# EAGLE board atmega_fusebit_doctor_V2_Custom_7_usb (EAGLE 8.5.1)
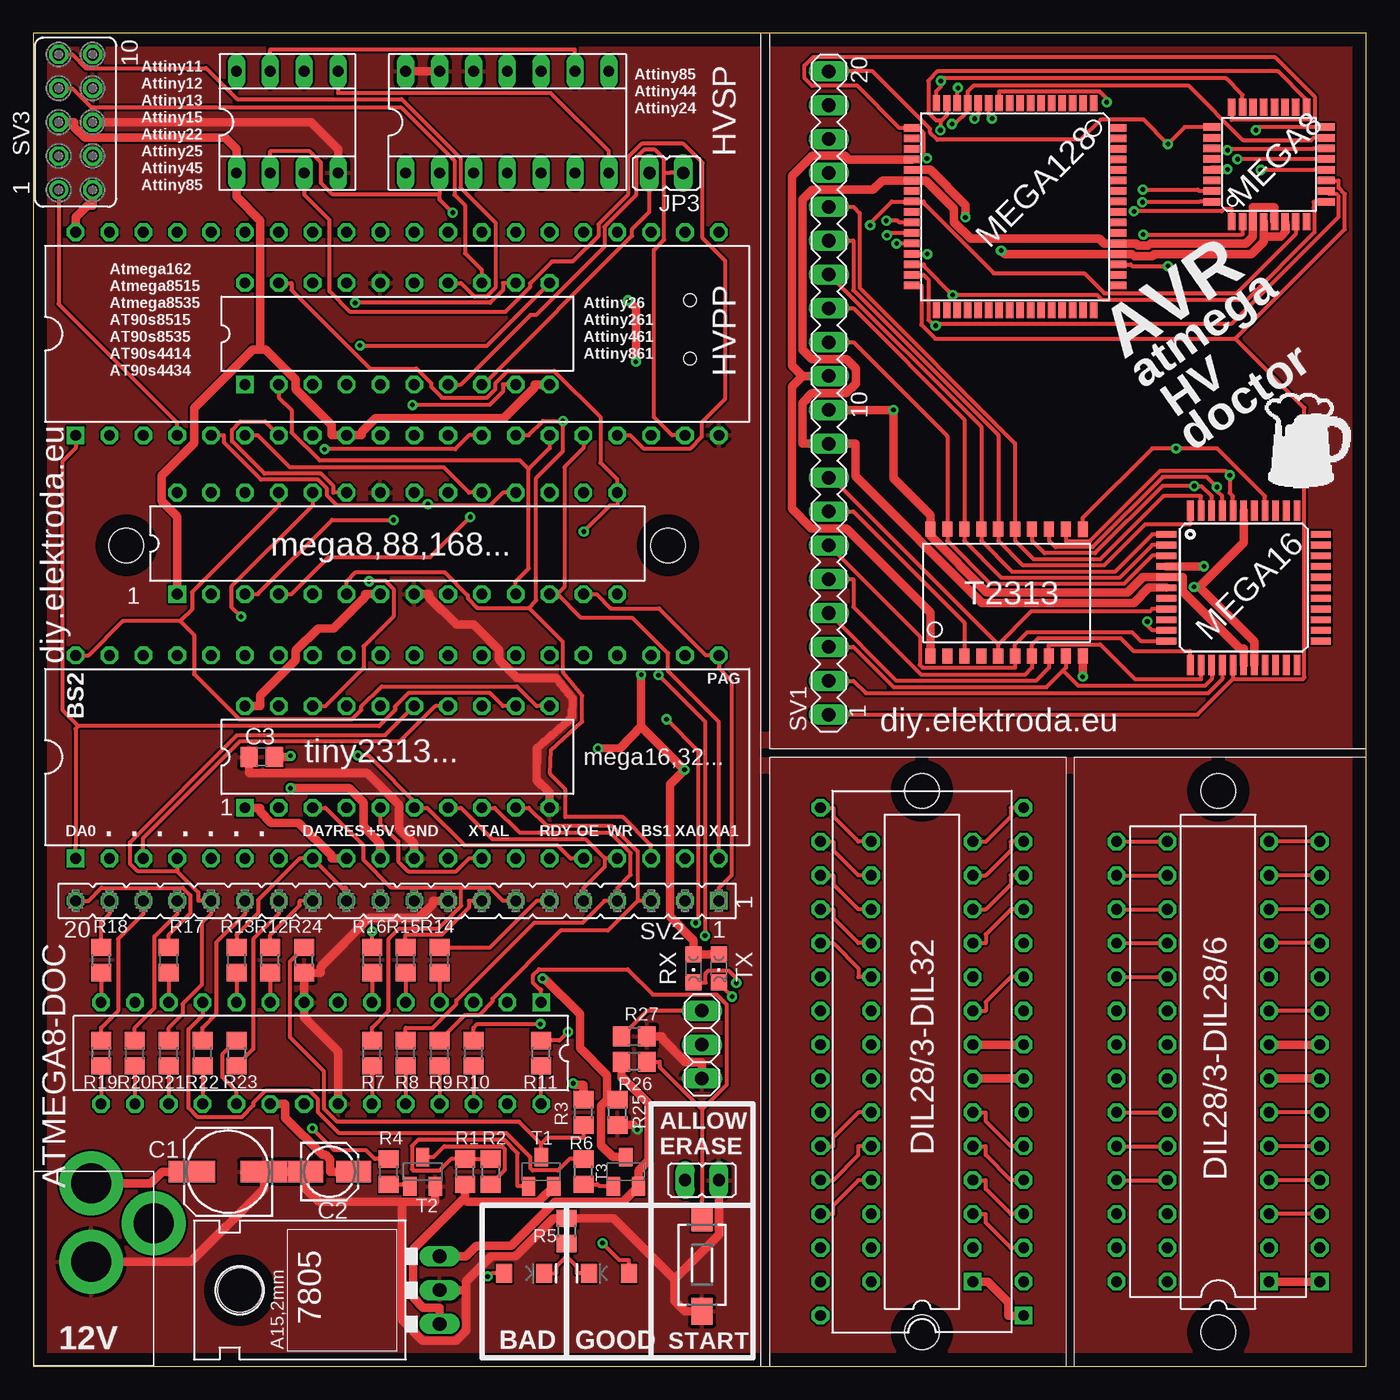
[diagram p3: board, top side]
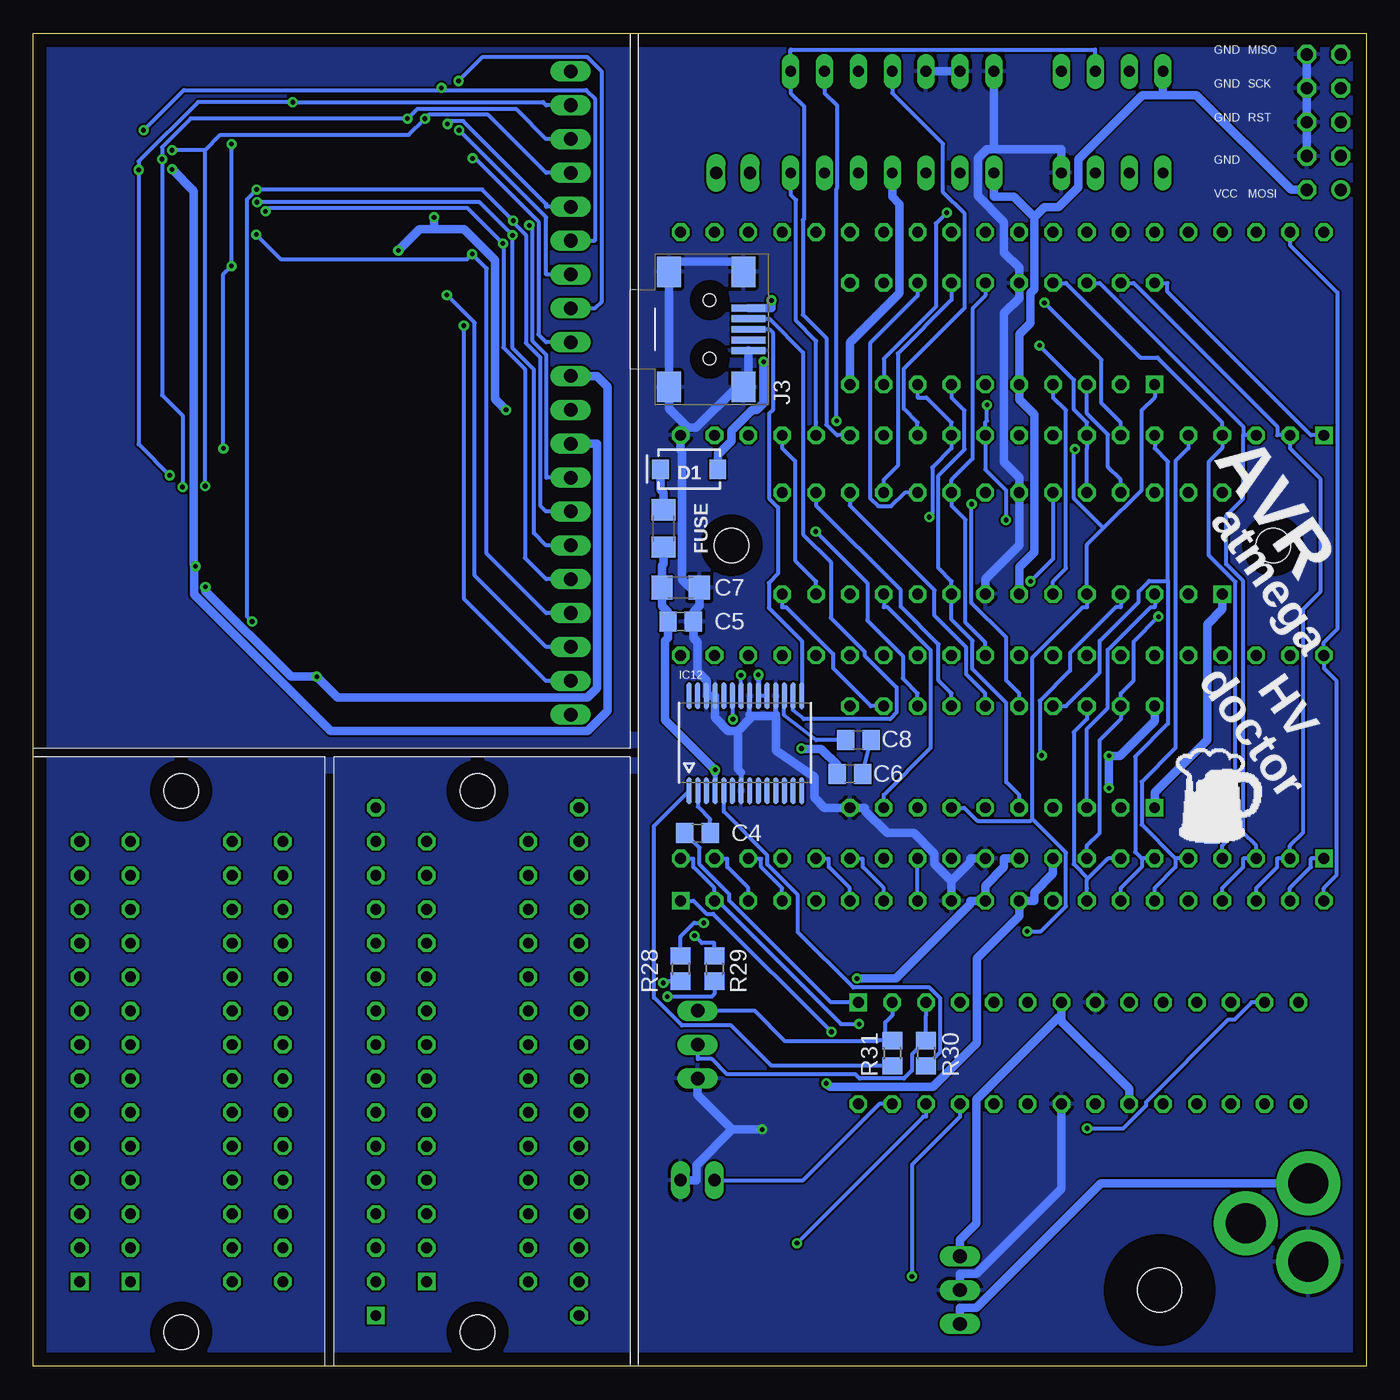
[diagram p4: board, bottom side, seen from below]

Size 100 x 100 mm. Coordinates in mm from the lower left corner, seen from the top.
Outline: 0,100 0,0 100,0 100,100 0,100
Copper layers (1*16): Top 0.035mm / dielectric 1.5mm / Bottom 0.035mm
Design rules "default": minimum track width 6mil, minimum drill 0.35mm, track to track 6mil, track to pad 6mil, pad to pad 6mil, via to via 6mil, smd to smd 6mil, copper to edge 40mil, drill to drill 6mil, minimum pad ring 10mil, minimum via ring 8mil, stop-mask expansion 4mil, vias tented up to drill 0mil, thermal gap 10mil
Net classes: 0 default: width 0.305 mm; 1 PWR: width 0.635 mm; 2 GND: width 0.635 mm
Holes 2.6 mm at 66.67,2.53 66.67,43.17 88.9,43.17 88.9,2.53 47.62,61.59 6.99,61.59

## Footprints (pad centres in the part's own frame; a part is rotated, then mirrored left to right if it is on the bottom)
153CLV-0605 = smd 3.5 x 1.6: + 2.7,0; - -2.7,0
153CLV-0405 = smd 2.6 x 1.6: + 1.8,0; - -1.8,0
C0805 = smd 1.3 x 1.5: 1 -0.95,0; 2 0.95,0
C1206 = smd 1.6 x 1.8: 1 -1.4,0; 2 1.4,0
SMA-DIODE = smd 1.27 x 1.47: A -2.15,0; C 2.15,0
1206 = smd 1.6 x 1.8: 1 -1.4,0; 2 1.4,0
78XXL = drill 1.016 long: GND 0,-3.81; IN -2.54,-3.81; OUT 2.54,-3.81 | hole 3.302: 0,11.176
DIL28-3_OCT = drill 0.813 square: 1 -16.51,-3.81 | drill 0.813 octagon: 2 -13.97,-3.81; 3 -11.43,-3.81; 4 -8.89,-3.81; 5 -6.35,-3.81; 6 -3.81,-3.81; 7 -1.27,-3.81; 8 1.27,-3.81; 9 3.81,-3.81; 10 6.35,-3.81; 11 8.89,-3.81; 12 11.43,-3.81; 13 13.97,-3.81; 14 16.51,-3.81; 15 16.51,3.81; 16 13.97,3.81; 17 11.43,3.81; 18 8.89,3.81; 19 6.35,3.81; 20 3.81,3.81; 21 1.27,3.81; 22 -1.27,3.81; 23 -3.81,3.81; 24 -6.35,3.81; 25 -8.89,3.81; 26 -11.43,3.81; 27 -13.97,3.81; 28 -16.51,3.81
DIL40_OCT = drill 0.813 square: 1 -24.13,-7.62 | drill 0.813 octagon: 2 -21.59,-7.62; 3 -19.05,-7.62; 4 -16.51,-7.62; 5 -13.97,-7.62; 6 -11.43,-7.62; 7 -8.89,-7.62; 8 -6.35,-7.62; 9 -3.81,-7.62; 10 -1.27,-7.62; 11 1.27,-7.62; 12 3.81,-7.62; 13 6.35,-7.62; 14 8.89,-7.62; 15 11.43,-7.62; 16 13.97,-7.62; 17 16.51,-7.62; 18 19.05,-7.62; 19 21.59,-7.62; 20 24.13,-7.62; 21 24.13,7.62; 22 21.59,7.62; 23 19.05,7.62; 24 16.51,7.62; 25 13.97,7.62; 26 11.43,7.62; 27 8.89,7.62; 28 6.35,7.62; 29 3.81,7.62; 30 1.27,7.62; 31 -1.27,7.62; 32 -3.81,7.62; 33 -6.35,7.62; 34 -8.89,7.62; 35 -11.43,7.62; 36 -13.97,7.62; 37 -16.51,7.62; 38 -19.05,7.62; 39 -21.59,7.62; 40 -24.13,7.62
DIL20_OCT = drill 0.813 square: 1 -11.43,-3.81 | drill 0.813 octagon: 2 -8.89,-3.81; 3 -6.35,-3.81; 4 -3.81,-3.81; 5 -1.27,-3.81; 6 1.27,-3.81; 7 3.81,-3.81; 8 6.35,-3.81; 9 8.89,-3.81; 10 11.43,-3.81; 11 11.43,3.81; 12 8.89,3.81; 13 6.35,3.81; 14 3.81,3.81; 15 1.27,3.81; 16 -1.27,3.81; 17 -3.81,3.81; 18 -6.35,3.81; 19 -8.89,3.81; 20 -11.43,3.81
SOCKED-08 = drill 0.813 long: 1 -3.81,-3.81; 2 -1.27,-3.81; 3 1.27,-3.81; 4 3.81,-3.81; 5 3.81,3.81; 6 1.27,3.81; 7 -1.27,3.81; 8 -3.81,3.81
SOCKED-14 = drill 0.813 long: 1 -7.62,-3.81; 2 -5.08,-3.81; 3 -2.54,-3.81; 4 0,-3.81; 5 2.54,-3.81; 6 5.08,-3.81; 7 7.62,-3.81; 8 7.62,3.81; 9 5.08,3.81; 10 2.54,3.81; 11 0,3.81; 12 -2.54,3.81; 13 -5.08,3.81; 14 -7.62,3.81
TQFP32-08 = smd 1.27 x 0.559: 1 -4.293,2.8; 2 -4.293,2; 3 -4.293,1.2; 4 -4.293,0.4; 5 -4.293,-0.4; 6 -4.293,-1.2; 7 -4.293,-2; 8 -4.293,-2.8; 17 4.293,-2.8; 18 4.293,-2; 19 4.293,-1.2; 20 4.293,-0.4; 21 4.293,0.4; 22 4.293,1.2; 23 4.293,2; 24 4.293,2.8 | smd 0.559 x 1.27: 9 -2.8,-4.293; 10 -2,-4.293; 11 -1.2,-4.293; 12 -0.4,-4.293; 13 0.4,-4.293; 14 1.2,-4.293; 15 2,-4.293; 16 2.8,-4.293; 25 2.8,4.293; 26 2,4.293; 27 1.2,4.293; 28 0.4,4.293; 29 -0.4,4.293; 30 -1.2,4.293; 31 -2,4.293; 32 -2.8,4.293
SSOP28 = smd 0.381 x 2.032: 1 0,0; 2 0.65,0; 3 1.3,0; 4 1.95,0; 5 2.6,0; 6 3.25,0; 7 3.9,0; 8 4.55,0; 9 5.2,0; 10 5.85,0; 11 6.5,0; 12 7.15,0; 13 7.8,0; 14 8.45,0; 15 8.45,7.112; 16 7.8,7.112; 17 7.15,7.112; 18 6.5,7.112; 19 5.85,7.112; 20 5.2,7.112; 21 4.55,7.112; 22 3.9,7.112; 23 3.25,7.112; 24 2.6,7.112; 25 1.95,7.112; 26 1.3,7.112; 27 0.65,7.112; 28 0,7.112
DIL32 = drill 0.813 square: 1 -19.05,-7.62 | drill 0.813 octagon: 2 -16.51,-7.62; 3 -13.97,-7.62; 4 -11.43,-7.62; 5 -8.89,-7.62; 6 -6.35,-7.62; 7 -3.81,-7.62; 8 -1.27,-7.62; 9 1.27,-7.62; 10 3.81,-7.62; 11 6.35,-7.62; 12 8.89,-7.62; 13 11.43,-7.62; 14 13.97,-7.62; 15 16.51,-7.62; 16 19.05,-7.62; 17 19.05,7.62; 18 16.51,7.62; 19 13.97,7.62; 20 11.43,7.62; 21 8.89,7.62; 22 6.35,7.62; 23 3.81,7.62; 24 1.27,7.62; 25 -1.27,7.62; 26 -3.81,7.62; 27 -6.35,7.62; 28 -8.89,7.62; 29 -11.43,7.62; 30 -13.97,7.62; 31 -16.51,7.62; 32 -19.05,7.62
SO20L = smd 0.762 x 1.143: 1 -5.08,-5.131; 2 -3.81,-5.131; 3 -2.54,-5.131; 4 -1.27,-5.131; 5 0,-5.131; 6 1.27,-5.131; 7 2.54,-5.131; 8 3.81,-5.131; 9 5.08,-5.131; 10 6.35,-5.131; 11 6.35,4.369; 12 5.08,4.394; 13 3.81,4.394; 14 2.54,4.394; 15 1.27,4.394; 16 0,4.394; 17 -1.27,4.394; 18 -2.54,4.394; 19 -3.81,4.394; 20 -5.08,4.394
TQFP44 = smd 1.5 x 0.5: 1 -5.8,4; 2 -5.8,3.2; 3 -5.8,2.4; 4 -5.8,1.6; 5 -5.8,0.8; 6 -5.8,0; 7 -5.8,-0.8; 8 -5.8,-1.6; 9 -5.8,-2.4; 10 -5.8,-3.2; 11 -5.8,-4; 23 5.8,-4; 24 5.8,-3.2; 25 5.8,-2.4; 26 5.8,-1.6; 27 5.8,-0.8; 28 5.8,0; 29 5.8,0.8; 30 5.8,1.6; 31 5.8,2.4; 32 5.8,3.2; 33 5.8,4 | smd 0.5 x 1.5: 12 -4,-5.8; 13 -3.2,-5.8; 14 -2.4,-5.8; 15 -1.6,-5.8; 16 -0.8,-5.8; 17 0,-5.8; 18 0.8,-5.8; 19 1.6,-5.8; 20 2.4,-5.8; 21 3.2,-5.8; 22 4,-5.8; 34 4,5.8; 35 3.2,5.8; 36 2.4,5.8; 37 1.6,5.8; 38 0.8,5.8; 39 0,5.8; 40 -0.8,5.8; 41 -1.6,5.8; 42 -2.4,5.8; 43 -3.2,5.8; 44 -4,5.8
TQFP64 = smd 1.194 x 0.559: 1 -7.76,5.905; 2 -7.76,5.118; 3 -7.76,4.331; 4 -7.76,3.543; 5 -7.76,2.756; 6 -7.76,1.968; 7 -7.76,1.181; 8 -7.76,0.394; 9 -7.76,-0.394; 10 -7.76,-1.181; 11 -7.76,-1.968; 12 -7.76,-2.756; 13 -7.76,-3.543; 14 -7.76,-4.331; 15 -7.76,-5.118; 16 -7.76,-5.905; 33 7.76,-5.905; 34 7.76,-5.118; 35 7.76,-4.331; 36 7.76,-3.543; 37 7.76,-2.756; 38 7.76,-1.968; 39 7.76,-1.181; 40 7.76,-0.394; 41 7.76,0.394; 42 7.76,1.181; 43 7.76,1.968; 44 7.76,2.756; 45 7.76,3.543; 46 7.76,4.331; 47 7.76,5.118; 48 7.76,5.905 | smd 0.559 x 1.194: 17 -5.905,-7.76; 18 -5.118,-7.76; 19 -4.331,-7.76; 20 -3.543,-7.76; 21 -2.756,-7.76; 22 -1.968,-7.76; 23 -1.181,-7.76; 24 -0.394,-7.76; 25 0.394,-7.76; 26 1.181,-7.76; 27 1.968,-7.76; 28 2.756,-7.76; 29 3.543,-7.76; 30 4.331,-7.76; 31 5.118,-7.76; 32 5.905,-7.76; 49 5.905,7.76; 50 5.118,7.76; 51 4.331,7.76; 52 3.543,7.76; 53 2.756,7.76; 54 1.968,7.76; 55 1.181,7.76; 56 0.394,7.76; 57 -0.394,7.76; 58 -1.181,7.76; 59 -1.968,7.76; 60 -2.756,7.76; 61 -3.543,7.76; 62 -4.331,7.76; 63 -5.118,7.76; 64 -5.905,7.76
DIL28-6 = drill 0.813 square: 1 -16.51,-7.62 | drill 0.813 octagon: 2 -13.97,-7.62; 3 -11.43,-7.62; 4 -8.89,-7.62; 5 -6.35,-7.62; 6 -3.81,-7.62; 7 -1.27,-7.62; 8 1.27,-7.62; 9 3.81,-7.62; 10 6.35,-7.62; 11 8.89,-7.62; 12 11.43,-7.62; 13 13.97,-7.62; 14 16.51,-7.62; 15 16.51,7.62; 16 13.97,7.62; 17 11.43,7.62; 18 8.89,7.62; 19 6.35,7.62; 20 3.81,7.62; 21 1.27,7.62; 22 -1.27,7.62; 23 -3.81,7.62; 24 -6.35,7.62; 25 -8.89,7.62; 26 -11.43,7.62; 27 -13.97,7.62; 28 -16.51,7.62
USB-MINI-B_2 = smd 0.508 x 2.54: 1 0,0; 2 0.8,0; 3 1.6,0; 4 2.4,0; 5 3.2,0 | smd 2.286 x 1.778: 6 -2.717,5.948; 7 -2.717,0.36; 8 5.918,0.36; 9 5.918,5.948 | hole 0.95: -0.6,2.9; 3.8,2.9
JP1 = drill 0.914 long: 1 0,-1.27; 2 0,1.27
1X03 = drill 1.016 long: 1 -2.54,0; 2 0,0; 3 2.54,0
LED-1206 = smd 1.2 x 1.4: A -1.5,0; C 1.5,0
R0805 = smd 1.3 x 1.5: 1 -0.95,0; 2 0.95,0
CHIPLED_0805 = smd 1.2 x 1.2: A 0,-1.05; C 0,1.05
DTSM-3 = smd 2 x 1.6: 1 -3.494,0; 2 3.494,0
MA20-1 = drill 1.016 long: 1 -24.13,0; 2 -21.59,0; 3 -19.05,0; 4 -16.51,0; 5 -13.97,0; 6 -11.43,0; 7 -8.89,0; 8 -6.35,0; 9 -3.81,0; 10 -1.27,0; 11 1.27,0; 12 3.81,0; 13 6.35,0; 14 8.89,0; 15 11.43,0; 16 13.97,0; 17 16.51,0; 18 19.05,0; 19 21.59,0; 20 24.13,0
FE20 = drill 0.813 square: 1 -24.13,0 | drill 0.813 octagon: 2 -21.59,0; 3 -19.05,0; 4 -16.51,0; 5 -13.97,0; 6 -11.43,0; 7 -8.89,0; 8 -6.35,0; 9 -3.81,0; 10 -1.27,0; 11 1.27,0; 12 3.81,0; 13 6.35,0; 14 8.89,0; 15 11.43,0; 16 13.97,0; 17 16.51,0; 18 19.05,0; 19 21.59,0; 20 24.13,0
FE05-2 = drill 0.914: 1 -5.08,1.27 | drill 0.914 octagon: 2 -5.08,-1.27; 3 -2.54,1.27; 4 -2.54,-1.27; 5 0,1.27; 6 0,-1.27; 7 2.54,1.27; 8 2.54,-1.27; 9 5.08,1.27; 10 5.08,-1.27
SOT23-BEC = smd 1 x 1.4: B -0.95,-1.1; C 0,1.1; E 0.95,-1.1
SOT23 = smd 1 x 1.4: 1 -0.95,-1.1; 2 0.95,-1.1; 3 0,1.1
PJ-102A = drill 3 pad 4.8: RING 0.1,-3.39; RING_SW -4.6,-6.29; TIP 0.1,-9.29

## Placement (x,y rotation side)
C1  100uF  [153CLV-0605]  14.61,14.59 180 top
C2  10uF  [153CLV-0405]  22.23,14.59 0 top
C3  10nF  [C0805]  17.14,45.71 180 top
C4  100nF  [C0805]  50.16,39.99 0 bottom
C5  100nF  [C0805]  51.44,55.87 0 bottom
C6  100nF  [C0805]  38.73,44.44 180 bottom
C7  4,7uF  [C1206]  51.44,58.41 0 bottom
C8  100nF  [C0805]  38.1,46.98 180 bottom
D1  1A/40V/500mV  [SMA-DIODE]  50.8,67.3 180 bottom
FUSE  6V/0.5A  [1206]  52.7,62.85 90 bottom
IC1  7805  [78XXL]  26.67,5.71 90 top
IC2  ATMEGA8-DOC  [DIL28-3_OCT]  21.59,23.48 180 top
IC3  MEGA16/32/644...  [DIL40_OCT]  27.3,45.71 0 top
IC4  MEGA8/88/168...  [DIL28-3_OCT]  27.3,61.73 0 top
IC5  AT90S2313/TINY2313  [DIL20_OCT]  27.3,45.71 0 top
IC6  [SOCKED-08]  19.05,93.34 0 top
IC7  [SOCKED-14]  35.56,93.34 0 top
IC8  AT90S8515PDIL40_OCT  [DIL40_OCT]  27.3,77.46 0 top
IC9  TINY26  [DIL20_OCT]  27.3,77.46 0 top
IC10  MEGA8/88/168...  [DIL28-3_OCT]  66.67,22.85 90 top
IC11  MEGA8-AI  [TQFP32-08]  92.71,90.16 90 top
IC12  FT232RL  [SSOP28]  50.8,43.17 0 bottom
IC13  [DIL32]  66.67,22.85 90 top
IC14  TINY2313  [SO20L]  72.39,58.41 0 top
IC15  MEGA16  [TQFP44]  90.81,58.41 0 top
IC16  MEGA128-A  [TQFP64]  73.66,86.98 270 top
IC17  MEGA8/88/168...  [DIL28-3_OCT]  88.9,22.85 90 top
IC18  [DIL28-6]  88.9,22.85 90 top
J3  [USB-MINI-B_2]  46.35,76.19 90 bottom
JP1  ERASE  [JP1]  50.16,13.96 90 top
JP2  RS232  [1X03]  50.16,24.12 90 top
JP3  HVSP  [JP1]  47.5,89.53 90 top
LED1  red  [LED-1206]  36.83,6.97 0 top
LED2  green  [LED-1206]  43.18,6.97 180 top
R1  10K  [R0805]  32.38,14.59 90 top
R2  1K  [R0805]  34.29,14.59 270 top
R3  100  [R0805]  41.27,19.04 90 top
R4  4K7  [R0805]  26.67,14.59 90 top
R5  330  [R0805]  40.01,10.15 270 top
R6  4K7  [R0805]  41.27,14.59 90 top
R7  1K  [R0805]  25.4,23.48 90 top
R8  1K  [R0805]  27.94,23.48 90 top
R9  1K  [R0805]  30.48,23.48 90 top
R10  1K  [R0805]  33.02,23.48 90 top
R11  1K  [R0805]  38.1,23.48 90 top
R12  1K  [R0805]  17.78,30.47 90 top
R13  1K  [R0805]  15.24,30.47 90 top
R14  1K  [R0805]  30.48,30.47 90 top
R15  1K  [R0805]  27.94,30.47 90 top
R16  1K  [R0805]  25.4,30.47 90 top
R17  1K  [R0805]  10.16,30.47 90 top
R18  1K  [R0805]  5.08,30.47 90 top
R19  1K  [R0805]  5.08,23.48 90 top
R20  1K  [R0805]  7.62,23.48 90 top
R21  1K  [R0805]  10.16,23.48 90 top
R22  1K  [R0805]  12.7,23.48 90 top
R23  1K  [R0805]  15.24,23.48 270 top
R24  1K  [R0805]  20.32,30.47 90 top
R25  100  [R0805]  43.81,19.04 90 top
R26  1K  [R0805]  45.09,22.85 180 top
R27  10K  [R0805]  45.09,24.75 0 top
R28  1K  [R0805]  51.44,29.84 270 bottom
R29  1K  [R0805]  48.9,29.84 270 bottom
R30  1K  [R0805]  33.02,23.48 270 bottom
R31  1K  [R0805]  35.56,23.48 270 bottom
RX  Red  [CHIPLED_0805]  49.53,29.84 180 top
START  DTSM-3  [DTSM-3]  50.16,7.61 90 top
SV1  [MA20-1]  59.69,73.02 90 top
SV2  [FE20]  27.3,34.91 180 top
SV3  [FE05-2]  3.17,93.34 90 top
T1  BC857  [SOT23-BEC]  38.1,14.59 0 top
T2  BC847  [SOT23]  29.21,14.59 0 top
T3  BC557  [SOT23-BEC]  44.45,14.59 0 top
TX  Green  [CHIPLED_0805]  51.44,29.84 180 top
U$3  2.1MMJACKTHM  [PJ-102A]  4.45,4.44 180 top

## Tracks (layer width: path | path; a pad name or v marks a point on that pad's centre or on a via)
1
  Top 0.305: IC10.5 71.45,16.5 71.45,15.84 73.33,13.96 IC13.5
2
  Top 0.305: IC10.6 71.45,19.04 71.45,18.38 73.33,16.5 IC13.6
3
  Top 0.635: IC18.1 IC17.1
4
  Top 0.635: IC13.8 IC10.7
5
  Top 0.635: IC13.9 IC10.8
7
  Top 0.305: IC10.9 71.45,26.66 71.45,27.32 73.33,29.2 IC13.11
9
  Top 0.305: IC10.11 71.45,31.74 71.45,32.4 73.33,34.28 IC13.13
10
  Top 0.305: IC13.14 73.33,36.82 73.33,36.16 71.45,34.28 IC10.12
11
  Top 0.305: IC13.15 73.33,39.36 73.33,38.7 71.45,36.82 IC10.13
12
  Top 0.305: IC13.16 73.33,41.9 73.33,41.24 71.45,39.36 IC10.14
13
  Top 0.305: IC13.17 60.02,41.9 60.02,41.24 61.9,39.36 IC10.15
14
  Top 0.305: IC13.18 60.02,39.36 60.02,38.7 61.9,36.82 IC10.16
15
  Top 0.305: IC13.19 60.02,36.82 60.02,36.16 61.9,34.28 IC10.17
16
  Top 0.305: IC13.20 60.02,34.28 60.02,33.62 61.9,31.74 IC10.18
17
  Top 0.305: IC10.19 61.9,29.2 61.9,29.86 60.02,31.74 IC13.21
19
  Top 0.305: IC18.3 IC17.3
20
  Top 0.305: IC18.4 IC17.4
21
  Top 0.305: IC18.5 IC17.5
22
  Top 0.305: IC18.6 IC17.6
23
  Top 0.305: IC13.27 60.02,16.5 60.02,17.16 61.9,19.04 IC10.23
24
  Top 0.305: IC10.24 61.9,16.5 61.9,15.84 60.02,13.96 IC13.28
25
  Top 0.305: IC13.29 60.02,11.42 60.02,12.08 61.9,13.96 IC10.25
29
  Top 0.635: IC13.1 73.17,3.8 73.17,4.79 71.61,6.34 IC10.1
31
  Top 0.305: IC10.3 71.45,11.42 71.45,10.76 73.33,8.88 IC13.3
32
  Top 0.305: IC10.4 71.45,13.96 71.45,13.3 73.33,11.42 IC13.4
33
  Top 0.635: IC18.7 IC17.7
34
  Top 0.635: IC18.8 IC17.8
35
  Top 0.305: IC18.9 IC17.9
37
  Top 0.305: IC18.11 IC17.11
38
  Top 0.305: IC18.12 IC17.12
39
  Top 0.305: IC18.13 IC17.13
40
  Top 0.305: IC18.14 IC17.14
41
  Top 0.305: IC18.15 IC17.15
42
  Top 0.305: IC18.16 IC17.16
43
  Top 0.305: IC18.17 IC17.17
44
  Top 0.305: IC18.18 IC17.18
45
  Top 0.305: IC18.19 IC17.19
47
  Top 0.305: IC18.23 IC17.23
48
  Top 0.305: IC18.24 IC17.24
49
  Top 0.305: IC18.25 IC17.25
+5V  (via drill 0.35 pad 0.76)
  Top 0.635: v38.2,29.09 38.34,29.09 41,26.42 41,23.86 43.06,21.81 43.06,19.99 | 43.06,19.99 43.17,19.99 R25.2 | 43.06,19.99 42.59,19.52 42.59,16.58 43.48,15.7 T3.C | IC4.7 24.91,57.92 24.91,57.71 22.54,55.35 21.35,55.35 19.68,53.68 19.68,53 17,50.32 17,49.52 IC5.20 | v19.3,43.37 23.68,43.37 24.77,42.28 24.77,40.49 26.04,39.22 IC3.10 | v19.3,45.79 19.21,45.71 C3.1 | SV3.2 4.45,87.07 4.04,87.07 3.17,86.21 IC8.40
  Bottom 0.635: SV3.2 5.63,88.26 12.72,95.35 15.24,95.35 | IC6.8 15.24,95.35 | 24.9,86.21 24.14,86.97 23.08,86.97 21.59,88.46 21.59,90.55 16.78,95.35 15.24,95.35 | 24.9,86.21 26.43,87.73 27.94,87.73 IC7.1 | 24.9,86.21 24.9,80.8 25.18,80.52 25.18,78.27 26.04,77.41 IC9.5 26.04,72.52 24.9,71.39 24.9,61.09 26.04,59.96 26.04,59.05 IC4.7 | v38.2,29.09 35.3,29.09 29.7,34.68 29.7,34.91 SV2.10 28.57,35.48 28.57,36.05 27.16,37.45 27.16,38.09 IC3.10 | v19.3,43.37 v19.3,45.79 18.47,45.79 15.88,48.39 IC5.20
+5V*  (via drill 0.35 pad 0.76)
  Top 0.559: IC16.52 | 66.75,89.76 66.74,89.74 IC16.21 | IC16.52 | 93.96,85.6 93.96,85.82 IC11.6
  Top 0.635: IC15.17 90.81,53.83 90.53,53.83 86.22,58.13 86.22,59.21 IC15.5 83.23,59.21 82.08,58.05 71.56,58.05 67.31,62.3 IC14.20 67.31,63.85 64.53,66.62 v64.53,71.75 61.49,71.75 SV1.10 | IC16.52 72.88,83.44 v72.61,83.71 | 66.75,89.76 67.3,89.76 69.93,87.12 v69.93,86.19 | IC16.52 82.42,83.44 82.59,83.27 83.94,83.27 84.12,83.44 91.37,83.44 92.31,84.38 92.31,84.76 | 93.96,85.6 93.96,85.14 93.58,84.76 92.31,84.76 | IC11.4 92.31,84.76
  Bottom 0.635: 69.93,85.3 67.66,85.3 65.35,82.99 65.35,72.57 v64.53,71.75 | 69.93,85.3 71.02,85.3 v72.61,83.71 | 69.93,85.3 v69.93,86.19
+12V  (via drill 0.35 pad 0.76)
  Top 0.635: R3.2 41.27,21.11 40.62,21.11 v40.51,21.22 | 17.03,76.25 17.44,76.25 19.68,74 19.68,73.3 22.36,70.62 22.36,69.84 IC8.9 24.62,69.84 24.62,70.07 25.68,71.13 35.31,71.13 37.6,73.43 37.6,73.65 IC9.10 | SV3.5 3.09,93.34 3.09,92.97 3.9,92.15 14.4,92.15 15.24,91.32 IC6.1 15.24,87.73 17.03,85.94 17.03,76.25 | IC4.1 10.79,63.74 9.64,64.9 9.64,66.82 12.06,69.24 12.06,71.87 16.45,76.25 17.03,76.25 | IC3.9 22.36,38.09 22.36,38.32 19.92,40.77 17.85,40.77 17,41.62 17,41.9 IC5.1
  Bottom 0.635: IC5.1 15.88,43.03 11.93,46.98 11.93,55.66 10.79,56.79 IC4.1 | IC3.9 23.5,36.96 24.91,35.55 24.91,34.91 SV2.11 26.04,33.79 29.21,30.61 29.21,24.26 32.52,20.96 40.24,20.96 v40.51,21.22 | IC7.4 35.56,87.73 35,87.18 35,80.51 38.73,76.78 38.73,74.78 IC9.10
+12V*  (via drill 0.35 pad 0.76)
  Top 0.635: v87.83,60.01 IC15.4 | IC11.29 89.52,89.76 89.56,89.79 v89.59,89.79 | 57.7,74.29 56.91,73.5 56.91,64.34 58.4,62.85 60.99,62.85 67.31,56.54 IC14.1 | IC16.20 61.19,90.53 60.91,90.81 58.45,90.81 56.91,89.27 56.91,75.07 57.7,74.29 | SV1.11 57.7,74.29
  Bottom 0.635: v89.59,89.79 87.95,88.15 87.95,60.13 v87.83,60.01 87.94,59.9 87.94,57.9 77.68,47.64 58.43,47.64 56.91,49.16 56.91,73.5 57.7,74.29 SV1.11
AVCC
  Bottom 0.305: IC9.15 28.57,80.31 29.54,79.34 29.54,68.08 31.11,66.51 IC4.20 31.11,64.58 30.06,63.52 30.06,55.78 28.57,54.3 IC3.30
BS1  (via drill 0.35 pad 0.76)
  Top 0.305: 37.18,56.9 37.73,57.45 37.73,66.64 39.74,68.65 v39.74,70.92 38.24,70.92 37.16,69.84 IC8.14 | IC4.6 23.5,58.88 24.19,59.58 30.84,59.58 32.58,57.84 32.58,57.62 33.3,56.9 37.18,56.9 | IC3.18 46.35,39.08 44.25,41.19 39.93,41.19 39.93,43.27 38.79,44.41 38.84,46.22 41.17,48.35 41.17,50.31 39.75,52.05 39.74,52.73 39.74,54.35 37.18,56.9 | R8.2 27.94,25.39 29.96,25.39 31.75,27.18 31.75,27.45 37.59,33.29 41.23,33.29 42.85,34.91 SV2.4 43.81,35.88 44.82,36.88 44.82,38.5 43.31,40.01 36.51,40.01 34.62,41.9 IC5.8 | IC6.7 17.78,98.77 40.64,98.77 IC7.9
  Bottom 0.305: IC3.18 45.39,38.09 45.39,37.45 43.81,35.88 SV2.4 | IC9.4 23.5,72.69 22.53,71.72 22.53,59.85 23.5,58.88 IC4.6 | v39.74,70.92 39.74,88.34 39.67,88.4 39.67,94.55 40.64,95.52 IC7.9
BS1*  (via drill 0.35 pad 0.76)
  Top 0.305: SV1.4 64.77,51.42 75.22,51.42 76.2,52.4 IC14.8 76.2,54.16 80.04,54.16 82.64,51.55 87.61,51.55 IC15.13 | IC11.2 90.71,84.93 90.69,84.9 v83.27,84.9 | IC16.29 v67.07,83.44
  Bottom 0.305: v83.27,84.9 81.39,83.02 67.49,83.02 v67.07,83.44 65.97,82.35 65.97,60.96 61.52,56.51 SV1.4
BS2
  Top 0.305: IC5.11 37.77,49.52 36.28,51.01 26.13,51.01 24.6,49.48 24.6,49.24 23.9,48.54 15.44,48.54 12.06,51.92 12.06,54.86 11.03,55.9 | 11.03,55.9 6.71,55.9 4.14,53.33 IC3.40 | 11.03,55.9 11.9,56.78 11.9,58.06 18.41,64.58 IC4.25 | R17.2 10.16,32.38 11.77,33.99 11.77,35.33 11.22,35.88 5.11,35.88 4.14,34.91 SV2.20
  Bottom 0.305: IC4.25 18.41,66.51 19.38,67.47 19.38,69.88 20.95,71.45 IC9.3 | SV2.20 3.17,35.88 2.21,36.85 2.21,51.4 3.17,52.37 IC3.40 3.17,54.3 2.16,55.31 2.16,80.56 5.71,84.12 IC8.39
BS2*  (via drill 0.35 pad 0.76)
  Top 0.305: SV1.20 62.96,97.15 67.27,92.83 67.27,92.56 67.82,92.01 78.56,92.01 80.08,93.52 83.3,93.52 v85.13,91.69 86.39,92.96 87.48,92.96 IC11.25 | IC16.51 82.32,82.65 82.43,82.55 v85.13,82.55 | IC14.11 78.74,63.66 83.94,68.86 v85.74,68.86 88.81,68.86 92.41,65.27 IC15.37
  Bottom 0.305: v85.13,91.69 v85.13,82.55 85.74,81.94 v85.74,68.86
COM
  Bottom 0.305: C6.1 C8.1
DATA0
  Top 0.305: 3.38,48.03 25.96,48.03 27.14,49.21 27.14,49.49 28.15,50.5 34.25,50.5 35.23,49.52 IC5.12 | 3.38,48.03 3.17,47.83 3.17,39.05 IC3.1 | 3.38,48.03 2.21,49.2 2.21,67.91 3.17,68.88 IC8.1 | SV2.19 5.71,33.95 5.08,33.31 R18.2
  Bottom 0.305: IC3.1 4.14,38.09 4.14,37.45 5.71,35.88 SV2.19 | IC9.20 14.91,81.27 14.91,80.61 4.14,69.84 IC8.1 | IC4.14 43.81,56.95 43.52,56.95 40.01,53.45 40.01,52.37 37.16,49.52 IC5.12
DATA0*  (via drill 0.35 pad 0.76)
  Top 0.305: IC15.40 90,65.27 89.76,65.51 v89.76,66.84 89.42,67.18 84.55,67.18 79.27,61.9 77.5,61.9 77.47,61.93 IC14.12 | v80.53,94.83 80.53,95.11 80,95.65 72.48,95.65 IC16.10 | v92.1,89.75 96.05,89.75 96.06,89.76 IC11.12
  Bottom 0.305: v89.76,66.84 92.1,69.17 v92.1,89.75 92.1,90.39 87.65,94.83 v80.53,94.83 61.75,94.83 61.52,94.61 SV1.19
DATA1  (via drill 0.35 pad 0.76)
  Top 0.305: IC9.19 19.38,81.27 19.38,80.74 25.27,74.85 28.75,74.85 29.84,73.75 29.84,73.48 30.66,72.67 34.04,72.67 34.67,73.3 34.67,73.75 35.59,74.67 39.09,74.67 42.55,71.21 42.55,67.78 43.81,66.51 IC4.15 43.81,64.58 43.26,64.58 v41.3,62.62 | R19.2 5.08,25.39 6.35,26.66 6.35,32.05 8.26,33.95 SV2.18
  Bottom 0.305: IC5.13 33.66,50.48 34.77,51.6 34.77,53.29 37.43,55.95 37.43,58.75 v41.3,62.62 | SV2.18 8.26,35.88 6.68,37.45 6.68,38.09 IC3.2 5.71,39.05 4.75,40.02 4.75,56.76 3.45,58.06 3.45,66.61 5.71,68.88 IC8.2 6.68,69.84 6.68,70.5 17.45,81.27 IC9.19
DATA1*  (via drill 0.35 pad 0.76)
  Top 0.305: v71.93,93.6 71.69,93.84 IC16.11 | IC15.41 89.2,65.27 88.8,65.67 v88.8,65.95 88.04,66.72 84.73,66.72 79.46,61.45 76.68,61.45 76.2,61.93 IC14.13 | v90.34,90.56 96.06,90.56 IC11.13
  Bottom 0.305: v88.8,65.95 88.8,71.31 90.34,72.86 v90.34,90.56 90.34,91.46 88.2,93.6 v71.93,93.6 71.18,94.34 63.8,94.34 61.52,92.07 SV1.18
DATA2
  Top 0.305: IC3.3 8.26,39.64 15.5,46.89 27.52,46.89 30.15,49.52 IC5.14 | SV2.17 10.79,33.95 9.11,32.26 9.11,26.88 7.62,25.39 R20.2
  Bottom 0.305: IC4.16 41.27,64.58 34.92,58.23 34.92,56.99 32.08,54.14 32.08,51.45 31.11,50.48 IC5.14 | SV2.17 10.79,35.88 9.22,37.45 9.22,38.09 IC3.3 8.26,39.05 9.22,40.02 9.22,58.89 10.5,60.17 10.5,63.82 9.22,65.09 9.22,69.84 | IC8.3 9.22,69.84 | IC9.18 19.99,81.27 9.22,70.5 9.22,69.84
DATA2*  (via drill 0.35 pad 0.76)
  Top 0.305: IC16.12 70.9,93.84 70.86,93.84 v70.62,93.6 | IC11.14 96.06,91.36 89.72,91.36 v89.59,91.24 | IC14.14 74.93,61.93 75.87,60.99 79.65,60.99 84.69,66.03 v87.11,66.03 87.64,66.03 88.41,65.27 IC15.42
  Bottom 0.305: 87.11,91.24 85.97,92.38 71.83,92.38 v70.62,93.6 70.33,93.88 65.88,93.88 61.52,89.53 SV1.17 | 87.11,91.24 v89.59,91.24 | v87.11,66.03 87.11,91.24
DATA3
  Top 0.305: 10.79,37.12 7.83,37.12 7.27,37.69 7.27,39.3 15.31,47.34 26.4,47.34 IC5.15 | 10.79,37.12 10.79,37.24 IC3.4 | 10.79,37.12 12.37,35.55 12.37,34.91 SV2.16 13.34,33.95 12.64,33.26 12.64,28.62 11.19,27.17 11.19,26.42 10.16,25.39 R21.2 | IC8.4 10.79,70.81 1.91,79.7 SV3.1
  Bottom 0.305: IC4.17 38.73,64.58 32.38,58.23 32.38,56.32 30,53.93 30,51.91 28.57,50.48 IC5.15 | IC3.4 10.79,39.05 9.81,40.04 9.81,58.84 11.8,60.82 11.8,67.87 10.79,68.88 IC8.4 10.79,70.81 15.67,75.68 16.94,75.68 22.53,81.27 IC9.17
DATA3*  (via drill 0.35 pad 0.76)
  Top 0.305: IC11.15 96.06,92.16 95.9,92 90.76,92 86.65,96.1 70.57,96.1 70.12,95.65 IC16.13 70.12,94.17 69.15,93.2 v68.93,93.2 | IC15.43 87.61,65.27 84.76,65.27 80.03,60.53 75.06,60.53 73.66,61.93 IC14.15 73.66,69.23 61.99,80.91 61.99,86.52 61.52,86.98 SV1.16
  Bottom 0.305: SV1.16 61.52,86.98 61.52,87.2 67.74,93.42 68.72,93.42 v68.93,93.2
DATA4  (via drill 0.35 pad 0.76)
  Top 0.305: IC9.14 32.08,81.27 33.11,80.24 34,80.24 34.66,80.91 34.66,85.81 32.05,88.42 32.05,90.64 27.62,95.06 15.3,95.06 12.96,97.4 3.94,97.4 2.92,98.42 SV3.9 | IC8.5 14.3,69.84 14.3,69.3 17.09,66.51 21.36,66.51 22.03,65.83 22.03,65.32 22.78,64.58 29.49,64.58 v29.6,64.68 29.72,64.56 34.25,64.56 35.23,65.54 IC4.18 | R22.2 12.7,25.39 13.73,26.42 13.73,31.8 15.88,33.95 SV2.15
  Bottom 0.305: IC5.16 26.04,50.48 27,51.45 27,54.67 29.6,57.27 v29.6,64.68 | IC4.18 36.2,66.51 35.14,67.56 35.14,75.98 31.11,80.01 31.11,80.31 IC9.14 | 14.3,38.09 16.84,40.63 16.84,43.84 14.3,46.38 14.3,67.91 13.34,68.88 IC8.5 | 14.3,38.09 14.3,37.45 15.88,35.88 SV2.15 | IC3.5 14.3,38.09
DATA4*  (via drill 0.35 pad 0.76)
  Top 0.305: IC15.44 86.81,63.16 83.41,63.16 80.32,60.07 74.25,60.07 72.39,61.93 IC14.16 72.39,69.85 61.52,80.72 61.52,84.45 SV1.15 | v69.38,95.9 69.33,95.85 69.33,95.65 IC16.14 | IC11.16 91.96,92.96 v91.73,92.73
  Bottom 0.305: 69.38,95.74 58.52,95.74 57.86,95.08 57.86,84.45 SV1.15 | v91.73,92.73 88.72,95.74 69.38,95.74 | 69.38,95.74 v69.38,95.9
DATA5
  Top 0.305: IC9.13 33.66,82.23 32.38,83.51 32.38,87.1 31.59,87.89 31.59,90.44 27.59,94.44 4.35,94.44 2.92,95.88 SV3.7 | IC8.6 16.84,69.84 19.26,67.42 30.81,67.42 32.69,65.54 IC4.19 | SV2.14 18.41,33.95 16.51,32.05 16.51,23.8 R23.2
  Bottom 0.305: IC4.19 34.62,65.54 35.64,64.52 36.6,64.52 37.21,65.13 37.21,76.75 33.66,80.31 IC9.13 | 16.84,38.09 16.84,37.45 18.41,35.88 SV2.14 | 14.86,58.91 14.86,48.2 17.32,45.74 17.32,38.57 16.84,38.09 | 16.84,38.09 | IC3.6 16.84,38.09 | 14.86,58.91 14.86,67.86 15.88,68.88 IC8.6 | 14.86,58.91 16.28,58.91 17.07,58.12 17.07,57.34 19.99,54.41 19.99,52.06 22.53,49.52 IC5.17
DATA5*  (via drill 0.35 pad 0.76)
  Top 0.305: IC11.17 95.51,95.03 93.39,97.15 67.85,97.15 67.14,96.44 67.14,94.04 67.72,93.46 68.06,93.46 | 68.06,93.46 68.16,93.46 68.54,93.84 IC16.15 | 68.06,93.46 v68.06,92.73 | SV1.14 71.12,70.48 IC14.17 71.12,61.93 73.45,59.6 81.14,59.6 83.95,62.41 IC15.1
  Bottom 0.305: v68.06,92.73 61.52,86.19 61.52,81.91 SV1.14
DATA6  (via drill 0.35 pad 0.76)
  Top 0.305: v25.18,58.88 25.24,58.94 26.4,58.94 27.02,58.32 27.02,56.26 24.77,54 24.77,52.37 21.92,49.52 IC5.18 | IC8.7 17.38,70.88 15.53,70.88 14.9,70.25 14.9,69.4 17.34,66.96 21.59,66.96 22.53,66.03 22.53,65.54 IC4.23 | v24.14,79.78 34.28,79.78 35.23,80.73 35.23,81.27 IC9.12 | SV2.13 19.99,34.91 19.99,34.59 17.78,32.38 R12.2
  Bottom 0.305: IC4.23 23.5,60.57 v25.18,58.88 | v24.14,79.78 19.86,75.5 19.86,72.25 18.41,70.81 IC8.7 | 20.86,36.61 19.38,38.09 IC3.7 | 20.86,36.61 20.95,36.52 20.95,35.88 SV2.13 | 20.86,36.61 21.93,37.67 21.93,47.58 20.95,48.55 IC5.18
DATA6*  (via drill 0.35 pad 0.76)
  Top 0.305: IC11.23 90.71,95.39 89.49,96.61 68.28,96.61 v68.09,96.43 68.09,95.98 67.75,95.65 IC16.16 | IC15.2 83.95,61.61 81.48,59.14 72.64,59.14 69.85,61.93 IC14.18 69.85,71.03 61.52,79.37 SV1.13
  Bottom 0.305: v68.09,96.43 66.28,98.23 58.45,98.23 57.38,97.17 57.38,79.84 57.86,79.37 SV1.13
DATA7  (via drill 0.35 pad 0.76)
  Top 0.305: v24.51,76.58 34.05,76.58 IC9.11 | v15.58,56.23 14.86,56.95 14.86,58.48 20.95,64.58 IC4.24 | SV2.12 23.5,35.88 23.16,35.88 IC3.8 19.99,38.09 16.86,34.97 16.86,34 15.24,32.38 R13.2
  Bottom 0.305: IC3.8 20.95,39.05 19.99,40.02 19.99,46.98 18.41,48.55 IC5.19 18.41,50.48 17.45,51.45 17.45,54.36 v15.58,56.23 | v24.51,76.58 21.92,73.99 21.92,71.77 20.95,70.81 IC8.8 20.95,69.36 20.95,68.88 IC4.24
DATA7*  (via drill 0.35 pad 0.76)
  Top 0.305: v67.05,90.62 66.81,90.86 66.81,92.52 66.44,92.89 IC16.17 65,92.89 61.82,96.07 58.42,96.07 57.85,96.64 57.85,97.57 58.51,98.24 93.14,98.24 96.13,95.25 96.13,93.7 95.94,93.51 89.91,93.51 IC11.24 | IC15.3 83.95,60.81 81.82,58.68 71.82,58.68 68.58,61.93 IC14.19 68.58,69.76 61.52,76.83 SV1.12
  Bottom 0.305: v67.05,90.62 66.84,90.62 62.1,85.88 62.1,77.41 61.52,76.83 SV1.12
GND  (via drill 0.35 pad 0.76)
  Top 0.635: SV2.9 29.98,34.91 29.98,34.68 28.92,33.62 25.2,33.62 21.54,29.95 21.54,29.52 R24.1 IC2.8 20.32,26.16 22.86,23.62 IC2.22 | 48.12,6.52 51.44,9.84 JP1.1 | 48.12,6.52 43.54,11.1 R5.1 39.04,11.1 36.18,8.25 34.36,8.25 32.47,6.36 32.47,5.71 | 48.12,6.52 48.12,4.9 48.9,4.12 START.1 | R25.1 45.03,18.09 45.03,18.05 v45.32,17.76 | IC4.8 29.7,57.92 29.7,57.69 31.77,55.62 33.03,55.62 34.92,53.73 34.92,53 36.3,51.63 39.22,51.63 40.44,50.08 40.44,48.68 39.19,47.59 38.58,47.06 37.8,46.37 37.77,44 38.73,43.03 IC5.10 | IC6.4 22.86,91.32 20.84,93.34 SV3.6 | 27.66,12.32 30.16,12.32 T2.2 | 27.66,12.32 21.43,12.32 20.43,13.32 C2.- C1.- 17.3,13.32 11.8,7.83 U$3.RING | 27.66,12.32 27.66,3.46 29.22,1.91 31.73,1.91 32.47,2.65 32.47,5.71 | IC7.14 IC7.13 | IC1.GND 32.47,5.71 | JP2.1 50.16,22.81 48.93,22.81 47.16,24.59 47.16,24.75 R27.2 | C3.2 16.2,44.49 25.06,44.49 27.45,42.1 27.45,40.35 28.57,39.22 IC3.11
  Bottom 0.381: 46.9,44.55 IC12.7 | 49.3,50.28 49.45,50.28 IC12.26 | 46.25,48.9 IC12.21 | 44.3,48.9 IC12.18 | 48.86,50.27 IC12.25
  Bottom 0.635: IC6.4 22.86,91.32 27.94,91.32 | 27.94,91.32 28.46,91.32 29.13,90.65 29.13,87.81 27.16,85.85 27.16,83.53 26.04,82.4 IC9.16 26.04,80.14 27.18,78.99 27.18,67.82 26.04,66.67 IC4.22 26.04,61.59 28.57,59.05 IC4.8 | 27.94,91.32 | 27.94,91.32 IC7.14 | 47.58,17.76 v45.32,17.76 | 47.58,17.76 50.16,20.35 JP2.1 | 47.58,17.76 50.25,15.09 50.25,13.96 JP1.1 | 47.14,47.66 46.11,48.69 46.11,48.76 | 47.14,47.66 47.87,47.66 48.86,48.66 48.86,50.27 49.28,50.27 49.3,50.28 | 47.14,47.66 47.14,44.79 46.9,44.55 | 46.11,48.76 46.25,48.9 | 44.3,48.76 46.11,48.76 | 44.3,48.76 44.3,48.9 | 44.3,48.76 44.3,46.18 41.4,44.19 41.4,42.69 40.63,41.9 IC5.10 37.6,41.9 37.6,41.67 35.93,39.99 33.95,39.99 32.38,38.43 32.38,37.67 31.12,36.41 | 31.12,36.41 31.11,36.4 SV2.9 | 31.12,36.41 29.7,37.82 29.7,38.09 IC3.11 | 49.45,50.28 49.45,51.4 50.16,52.12 50.16,54.33 50.48,54.65 C5.2 50.48,56.59 50.03,57.04 50.03,57.73 | SV3.4 SV3.6 SV3.8 SV3.10 | 50.87,70.41 52.3,71.84 J3.6 J3.9 51.55,82.86 47.46,82.86 J3.8 | 50.87,70.41 50.27,70.41 47.21,73.47 J3.7 46.35,73.83 J3.1 | 50.87,70.41 IC8.20 51.44,68.71 51.34,68.61 51.34,59.02 50.03,57.73 | C7.2 50.03,57.73 | IC2.22 22.86,13.32 29.25,6.94 30.48,6.94 IC1.GND | IC7.13 IC7.12
  pour Top: 0,0 0,100 100,100 100,0
  pour Bottom: 0,0 0,100 100,100 100,0
  cutout Bottom: 54.61,46.34 99.06,46.34 99.06,45.71 54.61,45.71
  cutout Bottom: 54.61,0.62 55.24,0.62 55.24,44.44 54.61,44.44
  cutout Bottom: 77.47,0.62 78.11,0.62 78.11,44.44 77.47,44.44
  cutout Bottom: 54.61,99.69 55.24,99.69 55.24,47.62 54.61,47.62
  cutout Top: 54.61,99.69 55.24,99.69 55.24,47.62 54.61,47.62
  cutout Top: 54.61,0.62 55.24,0.62 55.24,44.44 54.61,44.44
  cutout Top: 77.47,0.62 78.11,0.62 78.11,44.44 77.47,44.44
  cutout Top: 54.61,45.71 54.61,46.34 99.69,46.34 99.69,45.71
GND*  (via drill 0.35 pad 0.76)
  Top 0.635: IC15.6 83.71,58.41 82.56,57.27 71.19,57.27 61.68,66.77 61.68,69.21 SV1.9 57.7,69.21 57.7,72.27 58.42,72.99 60.97,72.99 61.71,73.73 61.71,74.85 61,75.56 58.42,75.56 57.7,76.28 57.7,87.51 58.44,88.26 63,88.26 63.69,88.95 IC16.22 66.43,88.95 66.97,88.95 69.09,86.83 69.09,85.84 70.33,84.6 79.98,84.6 80.35,84.23 IC16.53 82.49,84.23 82.74,84.23 82.92,84.05 83.62,84.05 83.79,84.23 90.98,84.23 91.51,84.76 IC11.3 91.51,86.97 93.11,86.97 IC11.5 | 87.49,58.47 90.81,61.78 IC15.39 | v87.09,58.47 87.49,58.47 | 87.49,58.47 91.61,54.35 IC15.18 | v78.73,51.73 v78.74,51.74 IC14.10
  Bottom 0.635: v87.09,58.47 87.09,58.17 80.65,51.73 v78.73,51.73 77.15,50.16 58.42,50.16 57.7,50.88 57.7,69.21 SV1.9
N$1
  Top 0.305: R6.1 42.33,13.64 42.48,13.5 T3.B
N$2
  Top 0.305: R18.1 IC2.14
N$3
  Bottom 0.305: C8.2 41.27,46.98 43.66,48.83 43.66,50.19 IC12.17
N$4
  Top 0.305: IC2.28 38.1,21.58 R11.1
N$5
  Top 0.305: R16.1 IC2.6
N$6
  Top 0.305: R14.1 IC2.4
N$8
  Top 0.305: T2.3 30.02,15.7 30.82,16.5 35.17,16.5 35.34,16.32 35.34,14.7 R2.2
N$9
  Top 0.305: R12.1 IC2.9
N$10
  Top 0.305: R13.1 IC2.10
N$11  (via drill 0.35 pad 0.76)
  Top 0.305: R4.2 25.61,15.55 24.97,16.2 22.58,16.2 v20.94,17.84
  Bottom 0.305: IC2.13 8.59,27.29 9.87,26.01 10.33,26.01 16.51,19.83 16.51,19.56 18.23,17.84 v20.94,17.84
N$12
  Top 0.305: IC2.11 12.7,26.33 11.64,25.27 11.64,19.36 12.32,18.69 15.64,18.69 16.51,19.56 16.51,19.77 17.38,20.64 20.73,20.64 21.36,20.01 21.36,19.06 22.95,17.47 35.5,17.47 37.3,15.67 37.3,14.85 37.47,14.68 39.35,14.68 40.22,15.55 R6.2
N$14
  Top 0.305: R19.1 IC2.15
N$16
  Top 0.305: R20.1 IC2.16
N$19
  Top 0.305: R15.1 IC2.5
N$21
  Top 0.305: R7.1 IC2.23
N$22
  Top 0.305: 38.1,16.7 36.46,18.34 22.8,18.34 21.82,19.32 21.82,22.11 19.26,24.67 19.26,30.36 R24.2 | 38.1,16.7 38.53,17.14 41.27,17.14 R3.1 | T1.C 38.1,16.7
N$24
  Top 0.305: R21.1 IC2.17
N$25
  Top 0.305: R22.1 IC2.18
N$26
  Top 0.305: IC2.19 15.24,20.64 14.19,21.7 14.19,23.38 R23.1
N$27
  Top 0.305: R17.1 IC2.12
N$29
  Top 0.305: R4.1 27.73,13.64 27.88,13.5 T2.1
N$31
  Bottom 0.305: IC2.27 36.52,19.68 42.24,13.96 JP1.2
N$32
  Top 0.305: LED2.C 40.77,6.97 40.77,7.47 40.01,8.25 | LED1.C 39.23,6.97 39.23,7.47 40.01,8.25 | R5.2 40.01,8.25
N$34
  Top 0.305: T1.B 36.34,13.5 36.34,15.97 35.34,16.98 28.86,16.98 28.41,16.53 28.41,14.79 28.51,14.69 30.48,14.69 31.33,15.55 R1.2 R2.1
N$41
  Bottom 0.305: IC12.2 50.15,41.98 49.22,41.05 C4.2
N$42
  Top 0.305: R8.1 IC2.24
N$44
  Bottom 0.305: J3.3 44.78,77.79 44.52,77.53 44.52,71.75 44.79,71.48 44.79,65.1 44.12,64.43 44.12,59.47 44.82,58.77 44.82,56.88 42.35,54.41 IC12.15
N$45
  Bottom 0.305: J3.4 44.78,78.59 42.24,76.05 42.24,62.4 40.17,60.32 40.17,56.15 37.63,53.61 37.63,53.33 35.23,50.93 35.23,49.05 35.71,48.55 42.19,48.55 43,49.2 IC12.16
N$46  (via drill 0.35 pad 0.76)
  Top 0.305: v47.51,48.54 49.88,46.17 49.88,33.44 v49.7,33.26
  Bottom 0.305: R28.1 51.44,32.24 50.42,33.26 v49.7,33.26 | v47.51,48.54 47.51,50.24 IC12.23
N$47  (via drill 0.35 pad 0.76)
  Top 0.305: LED2.A 44.68,7.98 43.96,7.98 v42.71,9.23 | R10.1 IC2.26
  Bottom 0.305: IC2.26 33.02,18.71 33.23,18.71 v42.71,9.23
N$48  (via drill 0.35 pad 0.76)
  Top 0.305: LED1.A 34.42,6.97 34.19,6.74 v34.08,6.74 | R9.1 IC2.25
  Bottom 0.305: IC2.25 30.48,18.71 34.08,15.11 v34.08,6.74
N$50  (via drill 0.35 pad 0.76)
  Top 0.305: v46.9,51.85 50.4,48.35 v50.4,32.29
  Bottom 0.305: R29.1 48.9,31.74 49.85,31.74 v50.4,32.29 | IC12.22 v46.9,51.85
N$51  (via drill 0.35 pad 0.76)
  Top 0.305: RX.C 50.44,28.79 50.44,29.46 50.66,29.69 52.16,29.69 52.74,29.11 v52.74,28.76
  Bottom 0.305: R28.2 52.49,28.88 52.61,28.88 v52.74,28.76
N$52  (via drill 0.35 pad 0.76)
  Top 0.305: TX.C 51.44,28.72 v52.43,27.73
  Bottom 0.305: v52.43,27.73 49.1,27.73 48.9,27.93 R29.2
OE  (via drill 0.35 pad 0.76)
  Top 0.305: 29.06,41.9 25.14,45.82 v24.35,45.82 | v24.35,45.82 | 29.06,41.9 29.54,41.9 32.35,39.09 39.31,39.09 40.31,38.09 IC3.16 | IC5.6 29.06,41.9 | v32.78,63.7 29.75,60.67 22.13,60.67 19.38,57.92 IC4.4 | IC9.8 33.77,73.65 44.92,84.8 44.92,85.3 46.23,86.6 JP3.2 | R14.2 34.27,31.42 37.77,34.91 SV2.6
  Bottom 0.305: IC4.4 18.41,56.95 18.78,56.95 22.23,53.51 22.23,52.18 24.49,49.92 24.49,45.96 v24.35,45.82 | IC3.16 40.31,38.09 40.31,37.45 38.73,35.88 SV2.6 | v32.78,63.7 32.56,63.92 32.56,67.43 31.11,68.88 IC8.12 31.11,70.32 31.11,70.81 32.99,72.69 33.66,72.69 IC9.8
OE*  (via drill 0.35 pad 0.76)
  Top 0.305: IC15.11 83.08,54.41 82.41,55.08 74.58,55.08 73.66,54.16 IC14.6 73.66,52.4 66.74,52.4 66.52,52.62 66.52,54.76 SV1.6 | v83.22,87.33 87.45,87.33 87.48,87.36 IC11.32 | IC16.27 64.21,85.02 v64.04,84.85
  Bottom 0.305: v83.22,87.33 66.52,87.33 v64.04,84.85 64.04,76.38 62.43,74.77 62.43,62.5 61.52,61.59 SV1.6
PAG  (via drill 0.35 pad 0.76)
  Top 0.305: v40.12,25.08 39.48,24.43 R11.2 | SV2.1 51.44,35.88 52.41,36.86 52.41,51.38 51.44,52.37 IC3.21 50.47,53.33 46.95,56.85 43.31,56.85 42.24,57.92 IC4.13 | IC6.3 20.32,87.9 22.23,85.99 22.23,80.65 23.78,79.1 35.4,79.1 37.27,80.97 37.27,81.23 38.91,82.87 40.47,82.87 42.39,84.79 42.39,85.67 44.61,87.89 44.61,90.7 45.62,91.71 48.78,91.71 50.21,90.28 50.21,84.62 51.91,82.92 51.91,72.58 50.16,70.83 50.16,69.73 49.3,68.86 45.76,68.86 44.78,69.84 IC8.17
  Bottom 0.305: SV2.1 50.47,34.91 49.5,33.95 48.99,33.95 v40.12,25.08 | IC8.17 43.81,68.88 42.85,67.91 42.85,60.46 41.27,58.88 IC4.13
PAG*
  Top 0.305: 90.18,77.08 98.41,85.3 98.41,87.95 97.94,88.41 97.94,88.96 IC11.11 | 90.18,77.08 67.68,77.08 66.61,78.14 66.61,81.08 IC16.32 | 90,51.55 95.25,51.55 95.37,51.68 95.37,71.88 90.18,77.08 | SV1.1 87.33,48.88 90,51.55 | IC15.16 90,51.55
RDY  (via drill 0.35 pad 0.76)
  Top 0.305: 32.1,35.89 26.86,35.89 24.77,37.99 24.77,39.05 21.92,41.9 IC5.3 | 32.1,35.89 32.1,34.54 30.4,32.83 27.45,32.83 26.67,32.05 26.67,26.66 25.4,25.39 R7.2 | 32.1,35.89 34.25,35.89 35.23,34.91 SV2.7 | v27.02,63.48 22.4,63.48 16.84,57.92 IC4.3 | v28.45,72.12 34.24,72.12 35.23,73.11 35.23,73.65 IC9.9 | v31.47,86.54 30.48,87.53 30.48,87.9 | 30.48,87.9 22.46,87.9 21.59,88.77 21.59,90.3 20.74,91.15 17.78,91.15 IC6.2 | IC7.2 30.48,87.9
  Bottom 0.305: IC3.15 37.77,38.09 37.77,37.45 36.2,35.88 SV2.7 | v28.45,72.12 28.45,70.94 28.57,70.81 IC8.11 28.57,67.27 27.02,65.72 v27.02,63.48 | v31.47,86.54 32.28,85.73 32.28,79.49 36.2,75.58 IC9.9 | IC4.3 15.88,56.95 16.18,56.95 19.39,53.74 19.39,49.38 20.95,47.82 IC5.3
RDY*  (via drill 0.35 pad 0.76)
  Top 0.305: v83.58,55.86 83.58,55.58 83.95,55.21 IC15.10 | IC14.3 69.85,55.79 61.52,64.12 SV1.7 | IC11.31 87.48,88.16 87.36,88.28 v83.24,88.28 | v63.99,85.94 64.86,85.94 65,85.8 IC16.26
  Bottom 0.305: v83.58,55.86 83.99,56.27 83.99,87.53 v83.24,88.28 66.33,88.28 v63.99,85.94 63.99,85.83 63.04,84.87 63.04,76.76 61.98,75.7 61.98,64.58 61.52,64.12 SV1.7
RX232
  Bottom 0.305: IC12.1 53.44,40.53 53.44,27.65 51.35,25.56 47.64,25.56 44.61,22.54 36.62,22.54 R31.2
RXD
  Top 0.305: JP2.3 46.04,26.66 R27.1
  Bottom 0.305: IC2.2 35.56,26.33 36.09,25.8 36.09,24.43 | 36.09,24.43 36.62,24.43 36.67,24.38 43.59,24.38 45.87,26.66 JP2.3 | R31.1 36.09,24.43
START
  Top 0.305: 50.16,19.28 52.01,21.12 52.01,27.14 51.27,27.88 46.49,27.88 44.59,29.78 37.93,29.78 37.5,29.35 37.5,28.75 37.99,28.26 38.1,28.26 IC2.1 | 50.16,19.28 50.16,12.41 START.2 | 50.16,19.28 46.99,22.45 46.99,22.85 R26.1
  Bottom 0.305: IC2.1 40.16,27.29 47.78,34.91 47.78,35.41 50,37.64 50,38.88 C4.1
TX232
  Bottom 0.305: R30.2 31.96,23.6 31.96,27.61 32.76,28.4 38.48,28.4 42.64,32.56 42.64,35.35 44.92,37.64 44.92,38.34 48.2,41.61 IC12.5
TXD
  Bottom 0.305: JP2.2 50.16,23.05 49.1,23.05 47.95,21.9 38.34,21.9 38.01,21.58 34.68,21.58 34.08,22.18 34.08,23.38 R30.1 33.02,26.33 IC2.3
V+
  Top 0.635: T1.E 37.88,12.32 32.59,12.32 32.38,12.52 | R1.1 32.38,12.52 | IC1.IN 30.48,4.4 29.25,4.4 28.48,5.16 28.48,8.78 32.23,12.52 32.38,12.52 | C1.+ 9.69,14.59 8.81,13.73 U$3.TIP
  Bottom 0.635: IC1.IN 30.48,4.4 29.25,4.4 19.92,13.73 U$3.TIP
VCC
  Top 0.635: C2.+ 22.25,14.59 22.25,15.53 21.92,15.86 21.69,15.86 18.91,18.65 18.91,19.68 IC2.20 | R26.2 44.13,21.63 44.24,21.63 46.17,19.7 46.17,15.44 45.4,14.66 T3.E 44.23,12.32 39.15,12.32 35.86,9.03 33.26,9.03 32.47,8.25 IC1.OUT
  Bottom 0.635: IC2.20 17.78,20.8 22.86,25.88 22.86,26.16 | IC2.7 22.86,26.16 | IC1.OUT 30.48,9.48 29.25,10.71 29.25,20.01 23.09,26.16 22.86,26.16
VUSB  (via drill 0.35, 0.35 pad 0.76)
  Top 0.635: TX.A RX.A 49.53,31.95 47.76,33.73 47.76,43.65 v48.85,44.75 45.6,48 | 45.6,48 v45.6,51.88 | v42.37,46.34 44.07,46.37 45.6,48
  Bottom 0.305: IC12.19 IC12.20
  Bottom 0.381: 48.85,44.55 IC12.4 | 45.6,51.66 IC12.20
  Bottom 0.406: C6.2 39.69,45.11 | 42.34,46.32 v42.37,46.34
  Bottom 0.635: 48.85,44.55 v48.85,44.75 52.59,48.48 52.59,54.45 52.38,54.65 C5.1 52.38,56.59 52.84,57.04 C7.1 52.84,60.05 52.7,60.19 FUSE.1 | 45.6,51.66 v45.6,51.88 | 39.69,45.11 40.89,46.32 42.34,46.32
VUSB_PREFUSE
  Bottom 0.635: FUSE.2 52.7,65.53 52.95,65.77 D1.C
VUSB_RAW  (via drill 0.35 pad 0.76)
  Top 0.635: v45.21,75.36 45.21,79.37 v44.62,79.96
  Bottom 0.635: v45.21,75.36 45.21,72.25 45.73,71.72 46.09,71.72 47.62,70.18 47.62,69.4 48.52,68.51 48.65,68.51 D1.A | v44.62,79.96 44.62,79.39 J3.5
WR  (via drill 0.35 pad 0.76)
  Top 0.305: v21.84,68.8 31.65,68.8 32.69,69.84 IC8.13 | 42.88,38.09 41.42,39.55 34.43,39.55 32.08,41.9 IC5.7 | v25.43,32.63 25.43,32.4 25.4,32.38 R16.2 | 42.88,38.09 42.88,37.48 41.27,35.88 SV2.5 | IC3.17 42.88,38.09
  Bottom 0.305: 19.7,62.89 21.92,65.1 21.92,68.72 v21.84,68.8 | v21.84,68.8 | 19.7,62.89 16.84,65.75 16.84,71.72 15.88,72.69 IC9.1 | 19.7,62.89 20.95,61.63 20.95,58.4 IC4.5 20.95,56.95 21.25,56.95 25.04,53.17 25.04,41.04 | 25.04,41.04 25.16,40.91 29.16,40.91 30.15,41.9 IC5.7 | v25.43,32.63 24.41,32.63 22.53,34.51 22.53,38.53 25.04,41.04 | IC7.11 35.56,95.52 31.75,91.71 31.75,88.08 30.12,86.45 30.12,79.41 34.68,74.84 34.68,71.83 33.66,70.81 IC8.13
WR*  (via drill 0.35 pad 0.76)
  Top 0.305: v82.58,86.64 89.16,86.64 89.33,86.81 89.91,86.81 IC11.1 | v64.77,84.23 65,84.23 IC16.28 | SV1.5 61.52,59.05 61.52,56.97 66.58,51.91 74.44,51.91 74.93,52.4 IC14.7 74.93,54.16 75.39,54.62 81.57,54.62 82.53,53.66 86.81,53.66 IC15.12
  Bottom 0.305: v82.58,86.64 82.35,86.88 67.42,86.88 v64.77,84.23 64.73,84.19 64.73,76.42 63.11,74.8 63.11,60.64 61.52,59.05 SV1.5
XA0
  Top 0.305: 37.16,67.3 38.73,68.88 IC8.15 | 37.16,67.3 37.16,59.85 36.2,58.88 IC4.11 | 37.16,67.3 36.5,67.96 21.47,67.96 19.38,70.05 19.38,71.72 18.41,72.69 IC9.2 | 45.33,34.91 43.1,32.68 39.56,32.68 34.45,27.57 34.45,27.35 33.43,26.33 32.38,26.33 R9.2 | 45.33,34.91 45.33,38.63 43.4,40.57 38.49,40.57 37.16,41.9 IC5.9 | 45.33,34.91 45.39,34.91 SV2.3
  Bottom 0.305: IC4.11 36.2,56.95 35.91,56.95 32.66,53.7 32.66,46.4 36.2,42.87 IC5.9 | IC3.19 47.93,38.09 47.93,37.45 46.35,35.88 SV2.3 | IC8.15 39.7,69.84 40.49,70.63 40.49,77.11 42.27,78.89 42.27,85.99 42.18,86.08 42.18,94.52 43.18,95.52 IC7.8 43.18,98.77 20.32,98.77 IC6.6
XA0*  (via drill 0.35 pad 0.76)
  Top 0.305: 77.25,52.18 77.47,52.4 IC14.9 | 77.25,52.18 76.02,50.95 64.54,50.95 61.52,53.96 SV1.3 | 77.25,52.18 78.39,51.04 87.89,51.04 88.41,51.55 IC15.14 | IC16.30 66.8,82.65 66.8,82.54 v68.97,80.37 79.82,80.37 80.19,80 91.05,80 96.12,85.07 96.12,86.83 96.06,86.89 96.06,87.36 IC11.9
  Bottom 0.305: SV1.3 61.52,53.96 66.89,59.34 66.89,78.29 v68.97,80.37
XA1  (via drill 0.35 pad 0.76)
  Top 0.305: 39.33,57.92 39.84,58.44 39.84,67.45 41.27,68.88 IC8.16 | 39.33,57.92 41.1,56.14 44.95,56.14 47.62,53.47 47.62,52.15 51.44,48.34 51.44,39.05 IC3.20 | v38.05,25.67 33.3,25.67 33.02,25.39 R10.2 | IC6.5 22.86,95.52 38.81,95.52 43.18,91.15 IC7.7 | IC4.12 39.33,57.92
  Bottom 0.305: IC7.7 43.18,87.9 42.78,87.5 42.78,78.43 41.27,76.93 41.27,70.81 IC8.16 | 48.9,35.16 39.41,25.67 v38.05,25.67 | 48.9,35.16 48.9,35.88 50.47,37.45 50.47,38.09 IC3.20 | SV2.2 48.9,35.16
XA1*  (via drill 0.35 pad 0.76)
  Top 0.305: 67.7,78.22 89.92,78.22 97.94,86.24 97.94,87.77 97.76,87.94 97.22,87.94 IC11.10 | 67.7,78.22 67.44,78.22 67.15,78.52 67.15,81.52 66.8,81.87 IC16.31 | v67.7,78.07 67.7,78.22 | IC15.15 89.2,51.55 88.14,50.49 62.45,50.49 61.52,51.42 SV1.2
  Bottom 0.305: v67.7,78.07 67.7,57.61 61.52,51.42 SV1.2
XTAL1
  Top 0.305: 47.32,89.53 47.32,84.5 46.55,83.73 46.55,71.22 47.93,69.84 IC8.19 | 47.32,89.53 47.32,90.58 46.65,91.25 45.81,91.25 45.21,90.66 45.21,87.84 | 45.21,87.84 | 45.21,87.84 42.85,85.48 42.85,83.98 37.73,78.86 37.29,78.86 | 37.29,78.86 | 37.29,78.86 32.08,73.65 IC9.7 | 47.32,89.53 47.75,89.53 JP3.1 | SV2.8 32.69,34.91 32.69,34.43 30.63,32.38 27.94,32.38 R15.2 | IC3.13 32.69,38.09 31.72,37.12 28.12,37.12 27.37,37.87 27.37,39.38 26.04,40.72 IC5.5
  Bottom 0.305: IC9.7 31.11,72.69 30.14,71.71 30.14,68.78 32.09,66.82 32.09,59.86 31.11,58.88 IC4.9 31.11,56.02 29.54,54.44 29.54,52.3 27,49.76 27,43.83 26.04,42.87 IC5.5 | SV2.8 IC3.13
XTAL1*  (via drill 0.35 pad 0.76)
  Top 0.305: 72.39,54.16 74.88,56.64 83.78,56.64 83.95,56.81 IC15.8 | 72.39,54.16 59.88,66.67 SV1.8 | IC14.5 72.39,54.16 | v62.79,85.6 62.79,85.76 64.4,87.38 IC16.24 66.8,87.38 66.8,87.25 72.05,81.99 78.84,81.99 80.34,80.5 90.28,80.5 94.71,84.93 IC11.7
  Bottom 0.305: v62.79,85.6 62.58,85.39 62.58,76.95 61.52,75.89 61.52,66.67 SV1.8

## Text on the board
tPlace: Attiny11 | Attiny12 | Attiny85 | Attiny13 | Attiny44 | Attiny15 | Attiny24 | Attiny22 | Attiny25 | Attiny45 | Attiny85 | AVR | Atmega162 | atmega | Atmega8515 | Atmega8535 | Attiny26 | AT90s8515 | Attiny261 | AT90s8535 | Attiny461 | AT90s4414 | Attiny861 | AT90s4434 | HV | doctor | mega8,88,168... | diy.elektroda.eu | BS2 | PAG | diy.elektroda.eu | tiny2313... | mega16,32... | DA0 | . . . . . . . | DA7 | RES | +5V | GND | XTAL | RDY | OE | WR | BS1 | XA0 | XA1 | ALLOW | ERASE | 12V | BAD | GOOD | START
bPlace: AVR | atmega | HV | doctor
tNames: HVSP | MEGA8 | MEGA128 | HVPP | 1 | T2313 | MEGA16 | 1 | 1 | DIL28/3-DIL32 | DIL28/3-DIL28/6 | 7805
bNames: MISO | GND | SCK | GND | RST | GND | GND | MOSI | VCC